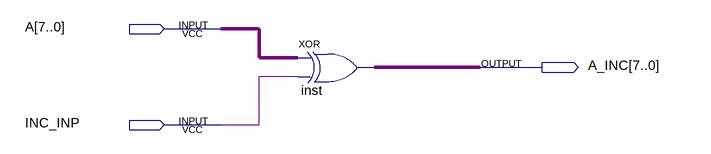
[diagram p0: schematic sheet]
// Quartus schematic INC_ALU.bdf as structural Verilog: 1 symbols, 3 pins
module INC_ALU (
  input  [7:0] A,
  input  INC_INP,
  output [7:0] A_INC
);

  assign A_INC = A ^ {8{INC_INP}};  // XOR inst, 8 bits wide
endmodule
